# EasyEDA Pro project ProProject_dc_to_dc_2024-05-25.epro

# Schematic Schematic1
Create Date: 2023-04-29; Page Name: P1; Project Name: dc_to_dc; Schematic Name: Schematic1; Update Date: 2024-04-25; Company: 嘉立创EDA; Page Size: A4; Version: V1.0
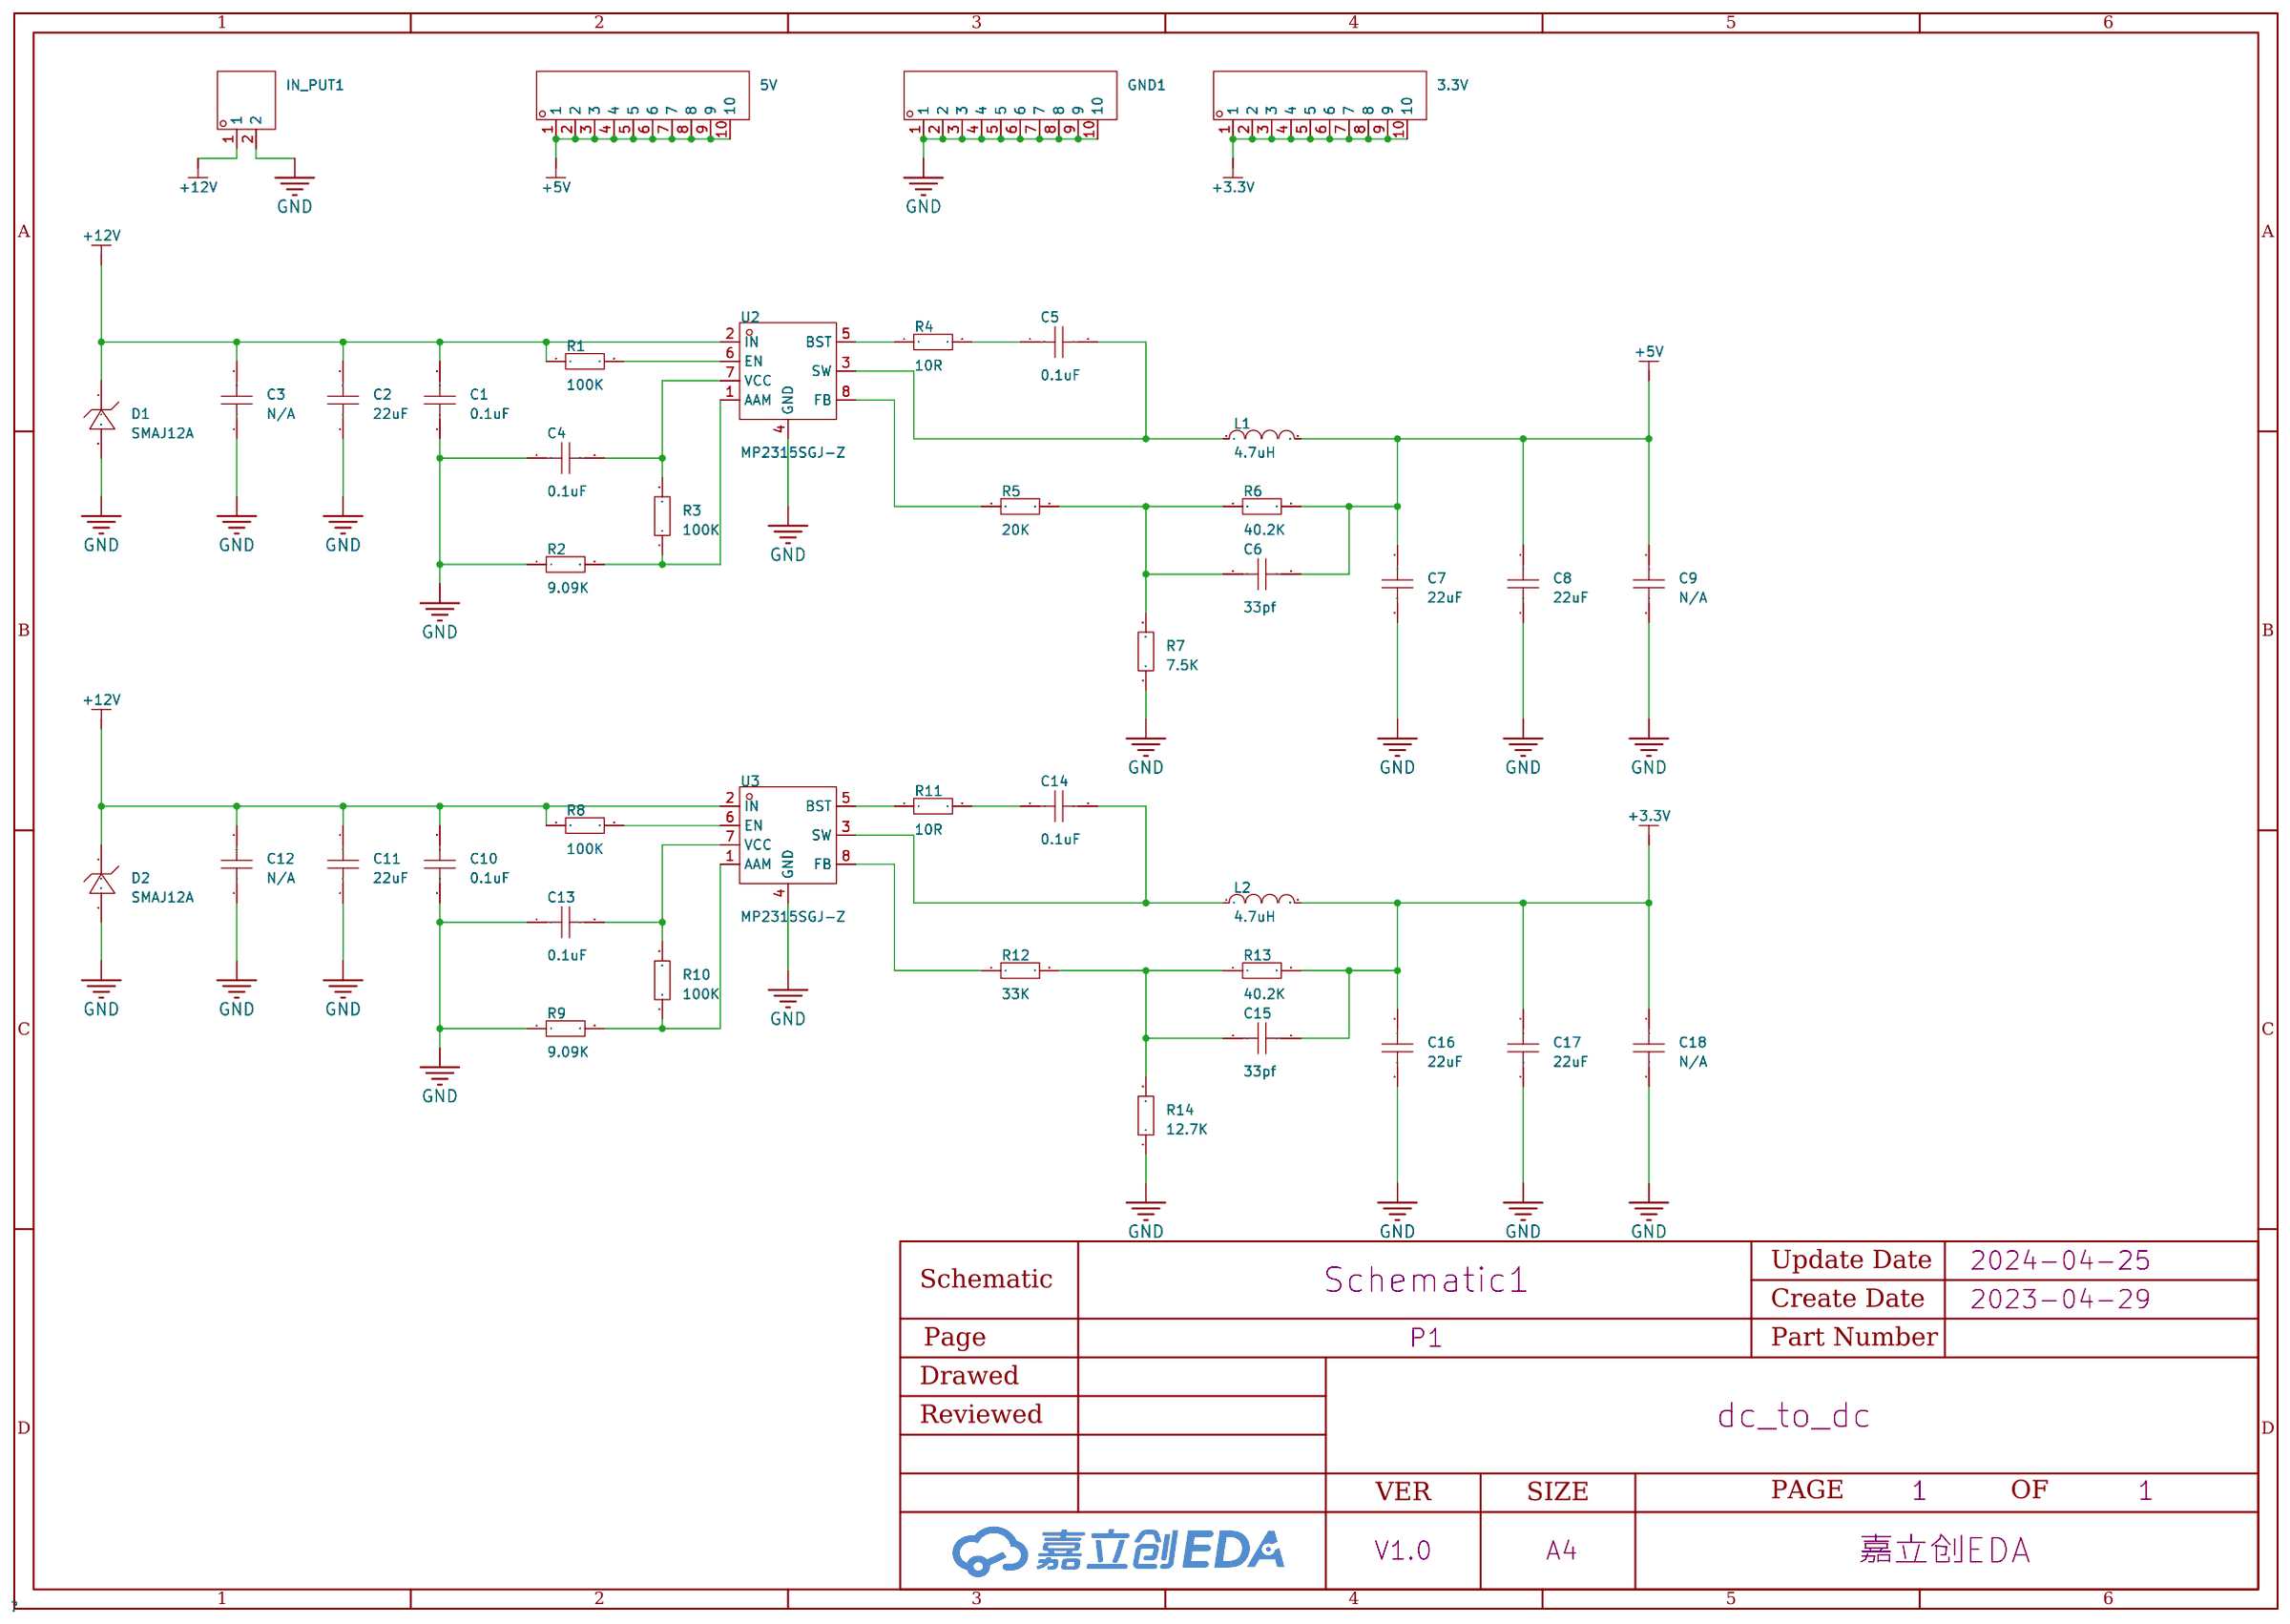
[diagram p0: schematic sheet]

## Parts
3.3V  -  [HDR-TH_10P-P2.54-V-M-1]
5V  -  [HDR-TH_10P-P2.54-V-M-1]
C1  0.1uF  [C0603]
C2  22uF  [C0603]
C3  N/A  [C0603]
C4  0.1uF  [C0603]
C5  0.1uF  [C0603]
C6  33pf  [C0603]
C7  22uF  [C0603]
C8  22uF  [C0603]
C9  N/A  [C0603]
C10  0.1uF  [C0603]
C11  22uF  [C0603]
C12  N/A  [C0603]
C13  0.1uF  [C0603]
C14  0.1uF  [C0603]
C15  33pf  [C0603]
C16  22uF  [C0603]
C17  22uF  [C0603]
C18  N/A  [C0603]
D1  SMAJ12A  [SMA_L4.4-W2.8-LS5.4-RD]
D2  SMAJ12A  [SMA_L4.4-W2.8-LS5.4-RD]
GND1  -  [HDR-TH_10P-P2.54-V-M-1]
IN_PUT1  -  [HDR-TH_2P-P2.54-V-M-1]
L1  4.7uH  [IND-SMD_L7.3-W6.6_MHCI06030]
L2  4.7uH  [IND-SMD_L7.3-W6.6_MHCI06030]
R1  100K  [R0603]
R2  9.09K  [R0603]
R3  100K  [R0603]
R4  10R  [R0603]
R5  20K  [R0603]
R6  40.2K  [R0603]
R7  7.5K  [R0603]
R8  100K  [R0603]
R9  9.09K  [R0603]
R10  100K  [R0603]
R11  10R  [R0603]
R12  33K  [R0603]
R13  40.2K  [R0603]
R14  12.7K  [R0603]
U2  MP2315SGJ-Z  [TSOT-23-8_L2.9-W1.6-P0.65-LS2.8-BL]
U3  MP2315SGJ-Z  [TSOT-23-8_L2.9-W1.6-P0.65-LS2.8-BL]

## Library data of the parts
3.3V 5V GND1 = HDR-M_2.54_1x10P: Supplier Part: C57369; Supplier Footprint: 插件
C1-C18 = CAP_0603: Supplier Footprint: 0603
D1 D2 = SMAJ12A_C220440: 极性:Unidirectional;峰值脉冲电流（10/1000us）:20.1A;箝位电压:19.9V;击穿电压（最小值）:13.3V;反向关断电压（典型值）:12V;; Supplier Part: C220440; Supplier Footprint: SMA(DO-214AC); JLCPCB Part Class: 扩展库; Datasheet: https://atta.szlcsc.com/upload/public/pdf/source/20180503/C220440_031FEAE6CED4FE4D44450934E4B33D24.pdf; Supplier: LCSC
IN_PUT1 = HDR-M_2.54_1x2P: Supplier Part: C124375; Supplier Footprint: 插件
L1 L2 = MHCI06030-4R7M-R8: 电感值:4.7uH;精度:±20%;额定电流:5.5A;饱和电流(Isat):9A;; LCSC Part Name: 4.7uH ±20% 5.5A 40mΩ; Supplier Part: C108295; Manufacturer: chilisin(奇力新); Supplier Footprint: SMD; JLCPCB Part Class: 扩展库; Datasheet: https://atta.szlcsc.com/upload/public/pdf/source/20170415/1492238384263.pdf; Supplier: LCSC; Tolerance: ±20%; Rated Current: 5.5A; Saturation Current (Isat): 9A; DC Resistance (DCR): 40mΩ
R1-R14 = Res_0603: Supplier Footprint: 0603
U2 U3 = MP2315SGJ-Z: Supplier Part: C3031493; Supplier Footprint: TSOT23-8; JLCPCB Part Class: 扩展库; Datasheet: https://atta.szlcsc.comnull; Supplier: LCSC

## Nets
+3.3V: 3.3V.1 3.3V.2 3.3V.3 3.3V.4 3.3V.5 3.3V.6 3.3V.7 3.3V.8 3.3V.9 3.3V.10 C15.2 C16.1 C17.1 C18.1 L2.2 R13.2
+5V: 5V.1 5V.2 5V.3 5V.4 5V.5 5V.6 5V.7 5V.8 5V.9 5V.10 C6.2 C7.1 C8.1 C9.1 L1.2 R6.2
+12V: C1.2 C2.2 C3.2 C10.2 C11.2 C12.2 D1.1 D2.1 IN_PUT1.1 R1.1 R8.1 U2.2(IN) U3.2(IN)
GND: C1.1 C2.1 C3.1 C4.1 C7.2 C8.2 C9.2 C10.1 C11.1 C12.1 C13.1 C16.2 C17.2 C18.2 D1.2 D2.2 GND1.1 GND1.2 GND1.3 GND1.4 GND1.5 GND1.6 GND1.7 GND1.8 GND1.9 GND1.10 IN_PUT1.2 R2.1 R7.1 R9.1 R14.1 U2.4(GND) U3.4(GND)
$1N440: R1.2 U2.6(EN)
$1N712: C4.2 R3.2 U2.7(VCC)
$1N792: R2.2 R3.1 U2.1(AAM)
$1N1001: R4.1 U2.5(BST)
$1N1049: C5.1 R4.2
$1N1375: C5.2 L1.1 U2.3(SW)
$1N1427: R5.1 U2.8(FB)
$1N1780: C6.1 R5.2 R6.1 R7.2
$1N2972: R8.2 U3.6(EN)
$1N2996: C13.2 R10.2 U3.7(VCC)
$1N3001: R9.2 R10.1 U3.1(AAM)
$1N3008: R11.1 U3.5(BST)
$1N3010: C14.1 R11.2
$1N3012: C14.2 L2.1 U3.3(SW)
$1N3019: R12.1 U3.8(FB)
$1N3044: C15.1 R12.2 R13.1 R14.2

# Board PCB1
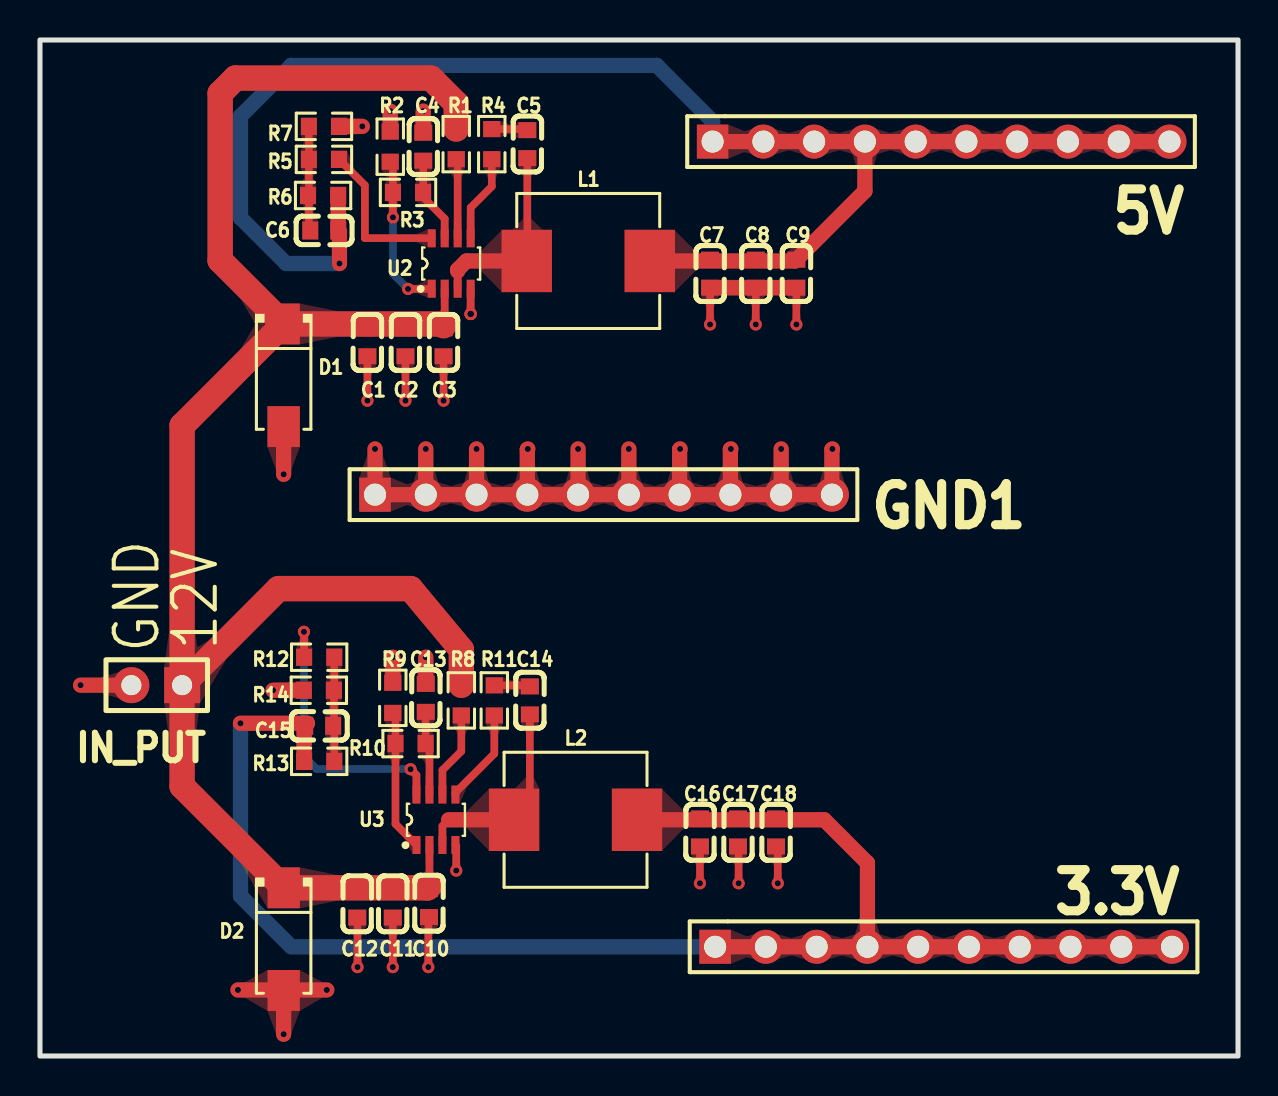
[diagram p1: board, top side]
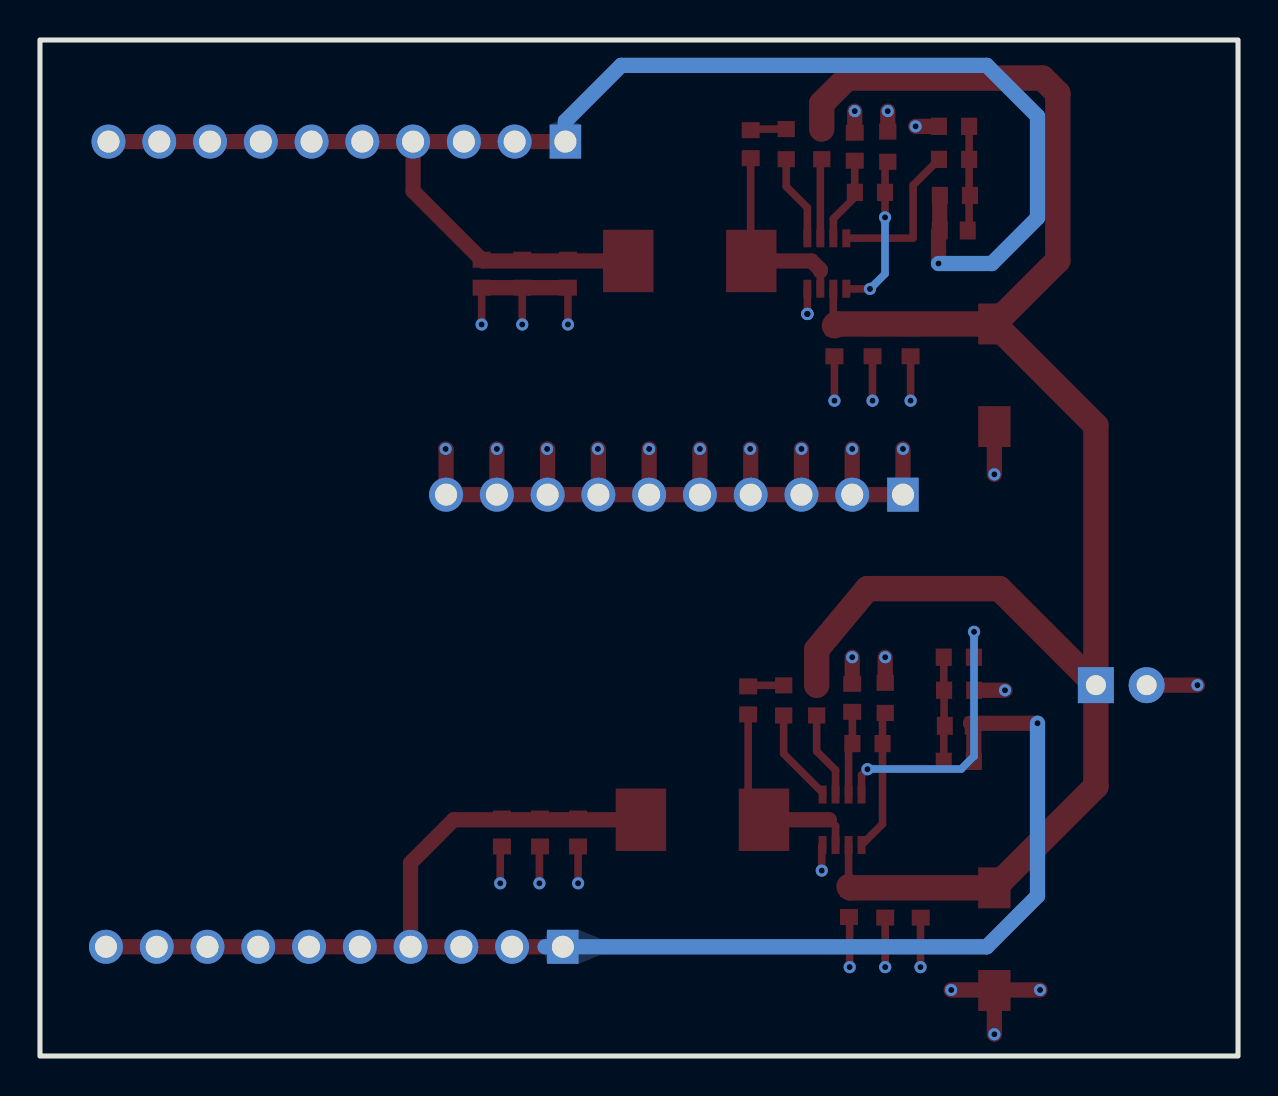
[diagram p2: board, bottom side, seen from below]

Outline 59.94 x 50.8 mm; copper layers: Top Layer, Bottom Layer. Coordinates in mm from the lower left corner of the outline.
Outline path: rectangle 0,50.8 59.94,0
Stack: Top Layer 0.035mm / Dielectric1 1.51mm FR4 er 4.5 / Bottom Layer 0.035mm

## Design rules (mm)
template: JLCPCB Capability(Two Layers Board)
spacing copperThickness1oz (default): track to track 0.102, other pairs 0.152 to 0.3
spacing copperThickness2oz: track to track 0.203, other pairs 0.152 to 0.3
track width copperThickness1oz (default): min 0.127, default 0.254, max 2.54
track width copperThickness2oz: min 0.203, default 0.254, max 2.54
differential pair differentialPair (default): width min 0.127, default 0.254, max 2.54; gap min 0.152, default 0.152
via viaSize (default): diameter min 0.5, default 0.61, max 10; hole min 0.3, default 0.305, max 6.3

## Placement (name value [footprint] x y rotation side)
3.3V  -  [HDR-TH_10P-P2.54-V-M-1]  45.21 5.46 0 top
5V  -  [HDR-TH_10P-P2.54-V-M-1]  45.09 45.72 0 top
C1  0.1uF  [C0603]  16.38 35.69 90 top
C2  22uF  [C0603]  18.29 35.69 90 top
C3  N/A  [C0603]  20.19 35.69 90 top
C4  0.1uF  [C0603]  19.18 45.47 270 top
C5  0.1uF  [C0603]  24.38 45.59 270 top
C6  33pf  [C0603]  14.22 41.27 0 top
C7  22uF  [C0603]  33.53 39.12 270 top
C8  22uF  [C0603]  35.81 39.12 270 top
C9  N/A  [C0603]  37.85 39.12 270 top
C10  0.1uF  [C0603]  19.47 7.65 90 top
C11  22uF  [C0603]  17.65 7.62 90 top
C12  N/A  [C0603]  15.88 7.62 90 top
C13  0.1uF  [C0603]  19.3 17.91 270 top
C14  0.1uF  [C0603]  24.51 17.78 270 top
C15  33pf  [C0603]  13.97 16.51 180 top
C16  22uF  [C0603]  33.02 11.18 270 top
C17  22uF  [C0603]  34.93 11.18 270 top
C18  N/A  [C0603]  36.83 11.18 270 top
D1  SMAJ12A  [SMA_L4.4-W2.8-LS5.4-RD]  12.19 34.04 270 top
D2  SMAJ12A  [SMA_L4.4-W2.8-LS5.4-RD]  12.19 5.84 270 top
GND1  -  [HDR-TH_10P-P2.54-V-M-1]  28.19 28.07 0 top
IN_PUT  -  [HDR-TH_2P-P2.54-V-M-1]  5.84 18.54 180 top
L1  4.7uH  [IND-SMD_L7.3-W6.6_MHCI06030]  27.43 39.75 0 top
L2  4.7uH  [IND-SMD_L7.3-W6.6_MHCI06030]  26.8 11.81 0 top
R1  100K  [R0603]  20.83 45.59 270 top
R2  9.09K  [R0603]  17.53 45.47 270 top
R3  100K  [R0603]  18.41 43.18 0 top
R4  10R  [R0603]  22.61 45.59 90 top
R5  20K  [R0603]  14.21 44.83 180 top
R6  40.2K  [R0603]  14.17 43.03 0 top
R7  7.5K  [R0603]  14.21 46.48 180 top
R8  100K  [R0603]  21.08 17.78 270 top
R9  9.09K  [R0603]  17.65 17.91 270 top
R10  100K  [R0603]  18.54 15.62 0 top
R11  10R  [R0603]  22.73 17.78 90 top
R12  33K  [R0603]  13.97 19.94 0 top
R13  40.2K  [R0603]  13.97 14.73 180 top
R14  12.7K  [R0603]  13.95 18.29 0 top
U2  MP2315SGJ-Z  [TSOT-23-8_L2.9-W1.6-P0.65-LS2.8-BL]  20.57 39.62 0 top
U3  MP2315SGJ-Z  [TSOT-23-8_L2.9-W1.6-P0.65-LS2.8-BL]  19.81 11.81 0 top

## Footprints (pads in the part's own frame, mm; a bottom-side part is the same pattern mirrored in y, then rotated)
C0603
  rect 0.8x0.9 smd: 1(-0.7,0) 2(0.7,0)
HDR-TH_2P-P2.54-V-M-1
  rect 1.8x1.8 hole 1: 1(-1.27,0)
  round 1.8 hole 1: 2(1.27,0)
HDR-TH_10P-P2.54-V-M-1
  rect 1.575x1.7 hole 1.1: 1(-11.43,0)
  round 1.7 hole 1.1: 2(-8.89,0) 3(-6.35,0) 4(-3.81,0) 5(-1.27,0) 6(1.27,0) 7(3.81,0) 8(6.35,0) 9(8.89,0) 10(11.43,0)
IND-SMD_L7.3-W6.6_MHCI06030
  rect 2.524x3.12 smd: 1(-3.078,0) 2(3.078,0)
R0603
  rect 0.806x0.864 smd: 1(-0.753,0) 2(0.753,0)
SMA_L4.4-W2.8-LS5.4-RD
  rect 2.046x1.62 smd: 1(-2.566,0) 2(2.566,0)
TSOT-23-8_L2.9-W1.6-P0.65-LS2.8-BL
  rect 0.4x0.9 smd: 1(-0.975,-1.26) 2(-0.325,-1.26) 3(0.325,-1.26) 4(0.975,-1.26) 5(0.975,1.26) 6(0.325,1.26) 7(-0.325,1.26) 8(-0.975,1.26)

## Nets
As in the schematic, except:
+12V: C1.2 C2.2 C3.2 C10.2 C11.2 C12.2 D1.1 D2.1 IN_PUT.1 R1.1 R8.1 U2.2 U3.2
GND: C1.1 C2.1 C3.1 C4.1 C7.2 C8.2 C9.2 C10.1 C11.1 C12.1 C13.1 C16.2 C17.2 C18.2 D1.2 D2.2 GND1.1 GND1.2 GND1.3 GND1.4 GND1.5 GND1.6 GND1.7 GND1.8 GND1.9 GND1.10 IN_PUT.2 R2.1 R7.1 R9.1 R14.1 U2.4 U3.4

## Via types
v1: diameter 0.61, hole 0.305, Top Layer to Bottom Layer, 43 vias

## Routing (per net, layer and track width the routed paths; a pad name or vN(x,y) marks a point on that pad's centre or on a via; arc(x,y) is an arc through that point)
+3.3V: length 79.1
  Top Layer w0.762: 3.3V.4 41.4,9.65 39.24,11.81 L2.2 ; 3.3V.4 3.3V.5 3.3V.8 3.3V.9 56.64,5.46 ; 3.3V.4 3.3V.1 ; R13.2 13.22,16.47 13.38,16.64 v1(10.03,16.64)
  Bottom Layer w0.762: 34.67,5.46 3.3V.1 12.57,5.46 10.03,8 v1(10.03,16.64)
+5V: length 78.7
  Top Layer w0.762: 14.92,41.39 14.92,43.02 R6.2 ; C6.2 14.99,41.21 v1(14.99,39.62) ; 5V.4 5V.5 5V.6 5V.7 5V.8 5V.9 5V.10 ; 5V.4 5V.3 5V.2 5V.1 ; 5V.4 41.28,43.24 37.78,39.75 30.51,39.75
  Bottom Layer w0.762: 5V.1 33.66,46.74 30.86,49.53 12.57,49.53 10.03,46.99 10.03,41.91 12.32,39.62 v1(14.99,39.62)
+12V: length 97.6
  Top Layer w0.381: 20.19,36.51 20.25,36.57 U2.2 ; U3.2 19.49,8.5
  Top Layer w1.27: 7.11,18.54 7.11,13.49 D2.1 19.4,8.41 19.47,8.47 ; 7.11,18.54 11.94,23.37 18.54,23.37 21.08,20.32 R8.1 ; 7.11,18.54 7.11,31.52 D1.1 ; D1.1 20.11,36.6 20.19,36.51 ; D1.1 9.02,39.78 9.02,48.13 9.78,48.89 19.56,48.89 20.83,47.62 R1.1
GND: length 96.9
  Top Layer w0.381: v1(35.81,36.58) C8.2 ; v1(15.89,4.44) 15.89,6.91 15.88,6.92 ; v1(33.02,8.64) C16.2 ; C10.1 19.43,6.91 v1(19.43,4.44) ; v1(17.65,4.44) C11.1 ; v1(20.19,32.77) C3.1 ; v1(36.91,8.64) 36.91,10.39 C18.2 ; v1(33.53,36.58) C7.2 ; U3.4 20.83,10.51 v1(20.83,9.27) ; v1(34.96,8.64) 34.96,10.45 C17.2 ; v1(18.29,32.77) C2.1 ; v1(21.55,37.1) U2.4 ; v1(37.85,36.58) C9.2 ; v1(16.38,32.77) C1.1
  Top Layer w0.762: GND1.5 v1(26.92,30.35) ; GND1.5 GND1.4 ; GND1.5 GND1.6 ; v1(34.57,30.35) 34.54,30.33 GND1.8 ; v1(12.19,1.09) D2.2 ; D2.2 12.17,3.3 v1(9.91,3.3) ; D2.2 12.22,3.3 v1(14.35,3.3) ; R9.1 v1(17.65,19.94) ; GND1.4 GND1.3 ; GND1.4 24.38,30.33 v1(24.41,30.35) ; C4.1 v1(19.18,47.24) ; v1(16.76,30.35) GND1.1 GND1.2 ; 14.96,46.48 v1(16.13,46.48) ; v1(32.03,30.35) 32,30.33 GND1.7 ; GND1.6 v1(29.46,30.35) ; GND1.6 GND1.7 ; C13.1 v1(19.3,19.94) ; GND1.3 GND1.2 ; GND1.3 v1(21.84,30.35) ; GND1.7 GND1.8 ; GND1.8 GND1.9 ; v1(39.65,30.35) 39.62,30.33 GND1.10 GND1.9 ; v1(2.03,18.54) IN_PUT.2 ; R14.1 v1(11.66,18.29) ; GND1.9 v1(37.08,30.35) ; C7.2 C8.2 C9.2 ; GND1.2 v1(19.3,30.35) ; v1(12.19,29.08) D1.2 ; R2.1 v1(17.53,47.24)
$1N440: length 4
  Top Layer w0.381: R1.2 20.9,44.77 U2.6
$1N712: length 4.3
  Top Layer w0.381: 19.17,42.93 19.18,42.93 ; 19.18,42.93 C4.2 ; 19.18,42.93 20.25,41.86 U2.7
$1N792: length 7.9
  Top Layer w0.381: U2.1 19.59,38.35 v1(18.41,38.35) ; v1(17.66,41.93) 17.66,44.58 R2.2
  Bottom Layer w0.381: v1(18.41,38.35) 17.66,39.11 v1(17.66,41.93)
$1N1001: length 4.4
  Top Layer w0.381: U2.5 21.55,42.42 22.61,43.47 R4.1
$1N1049: length 1.8
  Top Layer w0.381: R4.2 24.33,46.35 C5.1
$1N1375: length 9.7
  Top Layer w0.381: U2.3 20.9,39.24 ; C5.2 24.38,39.78
  Top Layer w0.762: 20.9,39.24 20.9,39.31 21.34,39.75 L1.1 24.38,39.78
$1N1427: length 7.8
  Top Layer w0.381: 14.96,44.83 16.26,43.54 16.26,40.89 19.59,40.89 U2.8
$1N1780: length 5.2
  Top Layer w0.381: R7.2 R5.2 13.45,41.33 13.4,41.27
$1N2972: length 4.3
  Top Layer w0.381: R8.2 21.08,15.24 20.14,14.3 U3.6
$1N2996: length 4.2
  Top Layer w0.381: U3.7 19.49,15.43 R10.2 19.3,17.2 C13.2
$1N3001: length 7.1
  Top Layer w0.381: R9.2 17.79,17.02 R10.1 17.79,11.6 U3.1
$1N3008: length 4.8
  Top Layer w0.381: U3.5 20.79,13.17 22.73,15.11 R11.1
$1N3010: length 1.8
  Top Layer w0.381: C14.1 24.46,18.53 R11.2
$1N3012: length 10.3
  Top Layer w0.381: 20.45,11.81 20.14,11.5 U3.3 ; C14.2 24.51,12.6 L2.1
  Top Layer w0.762: L2.1 20.45,11.81
$1N3019: length 14.5
  Top Layer w0.381: v1(13.21,21.21) 13.22,21.2 R12.1 ; U3.8 18.84,14.04 v1(18.54,14.34)
  Bottom Layer w0.381: v1(13.21,21.21) 13.21,14.99 13.84,14.35 18.53,14.35 v1(18.54,14.34)
$1N3044: length 5.3
  Top Layer w0.381: R12.2 14.72,18.3 R14.2 14.71,16.55 14.67,16.51 14.72,16.46 R13.1

## Copper pours and planes (outline as drawn; the poured copper is in the pictures)
GND on Top Layer: -0.13,50.8 59.94,50.8 59.94,0 -0.13,0
GND on Bottom Layer: 0,50.8 59.94,50.8 59.94,0 0,0

Small or netless copper shapes (teardrops, artwork), in the pictures only: 184 on Top Layer, 8 on Bottom Layer

## Text on the board
Top Silkscreen Layer: GND | 12V
